# EAGLE design MotorControl (EAGLE 5.03)
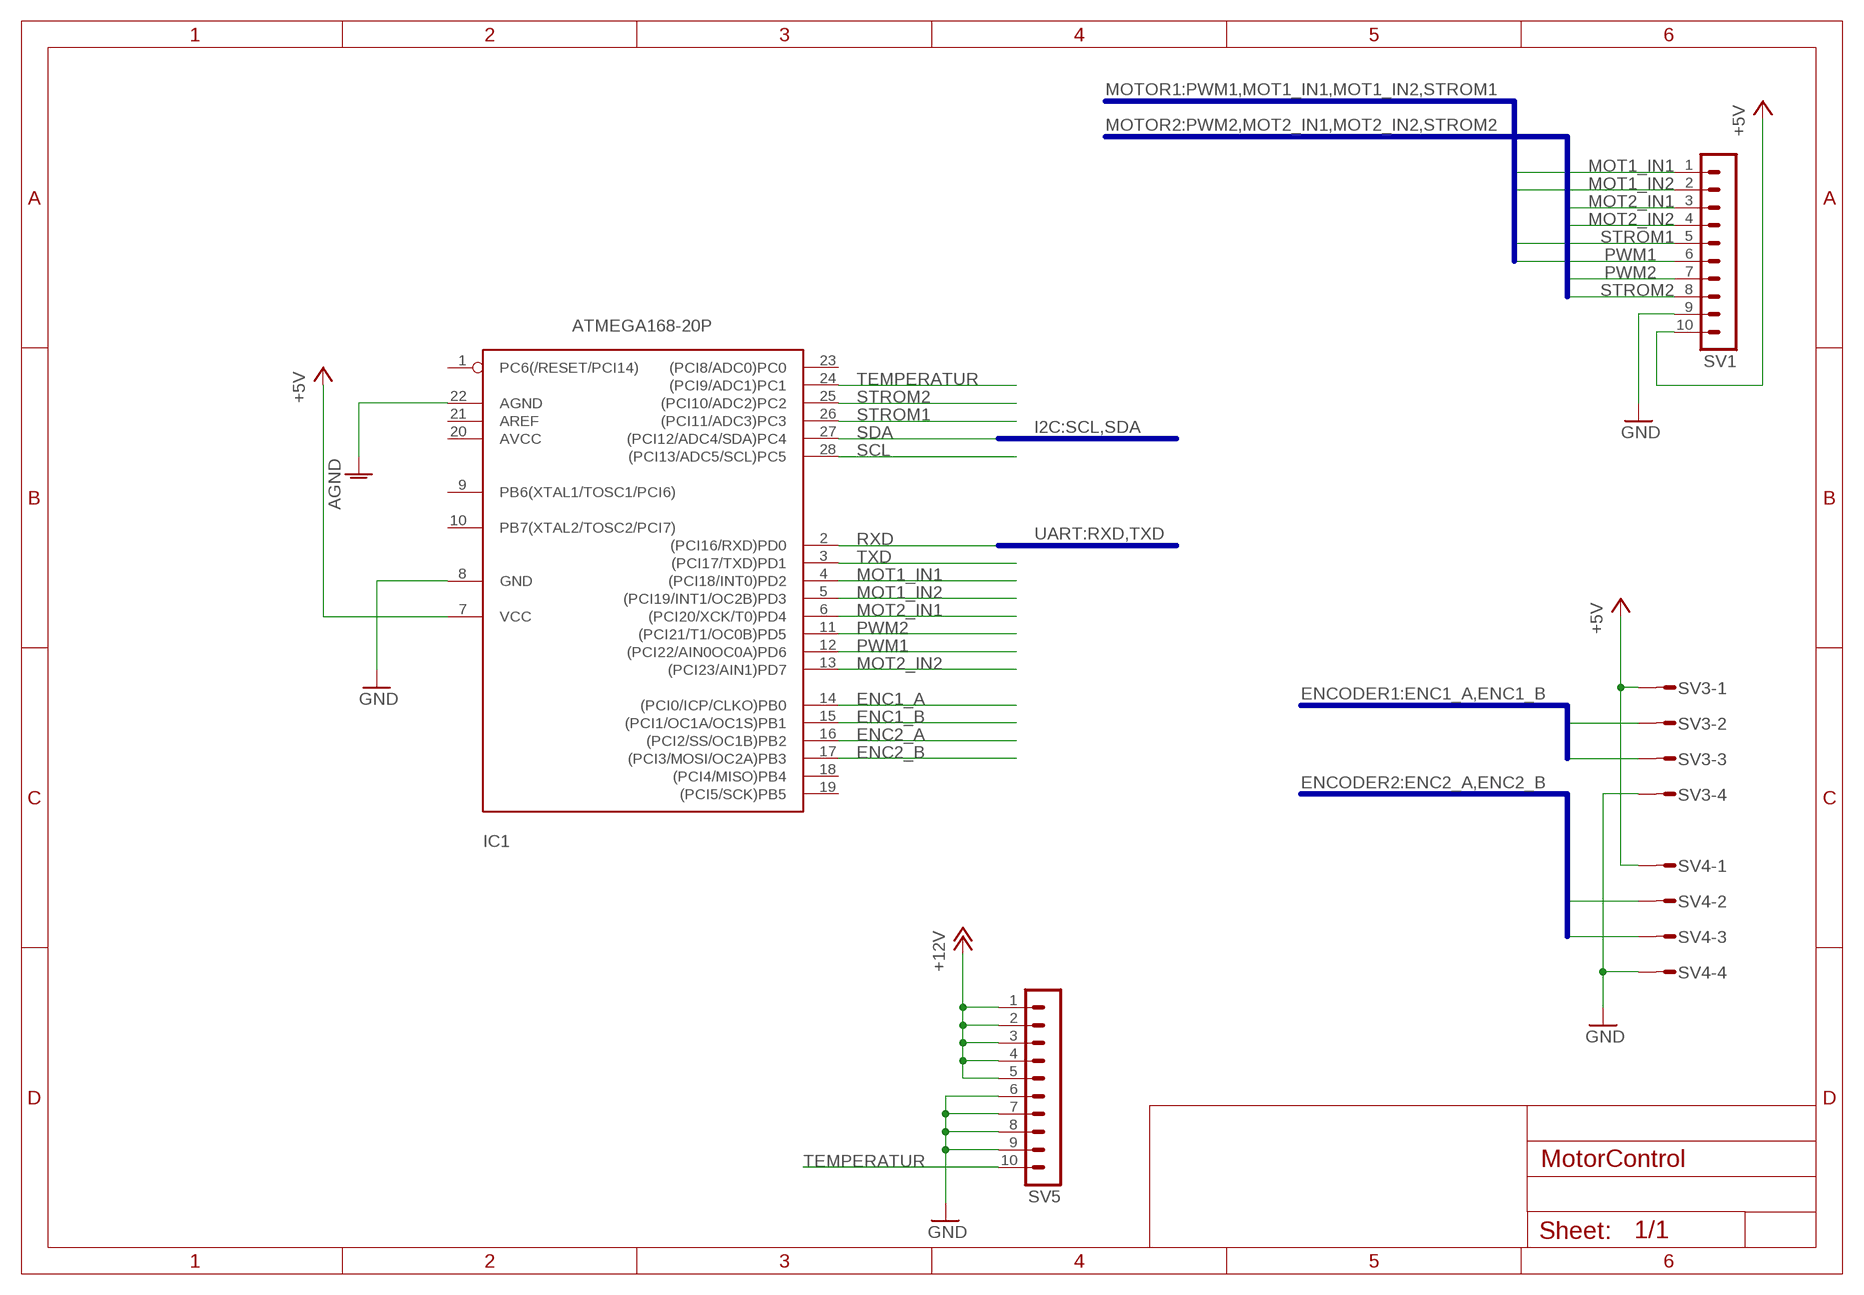
[diagram p0: schematic, sheet 1]

## Parts
IC1  ATMEGA168-20P  [DIL28-3]
SV1  MA10-1  [MA10-1]
SV3  S05P  [S05P]
SV4  S05P  [S05P]
SV5  MA10-1  [MA10-1]

## Nets
+5V: IC1.7(VCC) SV1.10 SV3.1 SV4.1
+12V: SV5.1 SV5.2 SV5.3 SV5.4 SV5.5
AGND: IC1.22(AGND)
ENC1_A: IC1.14((PCI0/ICP/CLKO)PB0) SV3.3
ENC1_B: IC1.15((PCI1/OC1A/OC1S)PB1) SV3.2
ENC2_A: IC1.16((PCI2/SS/OC1B)PB2) SV4.3
ENC2_B: IC1.17((PCI3/MOSI/OC2A)PB3) SV4.2
GND: IC1.8(GND) SV1.9 SV3.4 SV4.4 SV5.6 SV5.7 SV5.8 SV5.9
MOT1_IN1: IC1.4((PCI18/INT0)PD2) SV1.1
MOT1_IN2: IC1.5((PCI19/INT1/OC2B)PD3) SV1.2
MOT2_IN1: IC1.6((PCI20/XCK/T0)PD4) SV1.3
MOT2_IN2: IC1.13((PCI23/AIN1)PD7) SV1.4
PWM1: IC1.12((PCI22/AIN0OC0A)PD6) SV1.6
PWM2: IC1.11((PCI21/T1/OC0B)PD5) SV1.7
RXD: IC1.2((PCI16/RXD)PD0)
SCL: IC1.28((PCI13/ADC5/SCL)PC5)
SDA: IC1.27((PCI12/ADC4/SDA)PC4)
STROM1: IC1.26((PCI11/ADC3)PC3) SV1.5
STROM2: IC1.25((PCI10/ADC2)PC2) SV1.8
TEMPERATUR: IC1.24((PCI9/ADC1)PC1) SV5.10
TXD: IC1.3((PCI17/TXD)PD1)
Unconnected: IC1.1(PC6(/RESET/PCI14)) IC1.9(PB6(XTAL1/TOSC1/PCI6)) IC1.10(PB7(XTAL2/TOSC2/PCI7)) IC1.18((PCI4/MISO)PB4) IC1.19((PCI5/SCK)PB5) IC1.20(AVCC) IC1.21(AREF) IC1.23((PCI8/ADC0)PC0) SV3.5 SV4.5

## Buses
I2C:SCL,SDA
UART:RXD,TXD
MOTOR1:PWM1,MOT1_IN1,MOT1_IN2,STROM1
MOTOR2:PWM2,MOT2_IN1,MOT2_IN2,STROM2
ENCODER1:ENC1_A,ENC1_B
ENCODER2:ENC2_A,ENC2_B

## Library data of the parts
IC1 = avr:ATMEGA168*P: MICROCONTROLLER 16 kBytes FLASH 1 kBytes SRAM 512 Bytes EEPROM USART 8-channel 10 bit ADC
SV1 SV5 = con-lstb:MA10-1: PIN HEADER
SV3 SV4 = con-amp-mt:S05P: AMP MT CONNECTOR

## Board
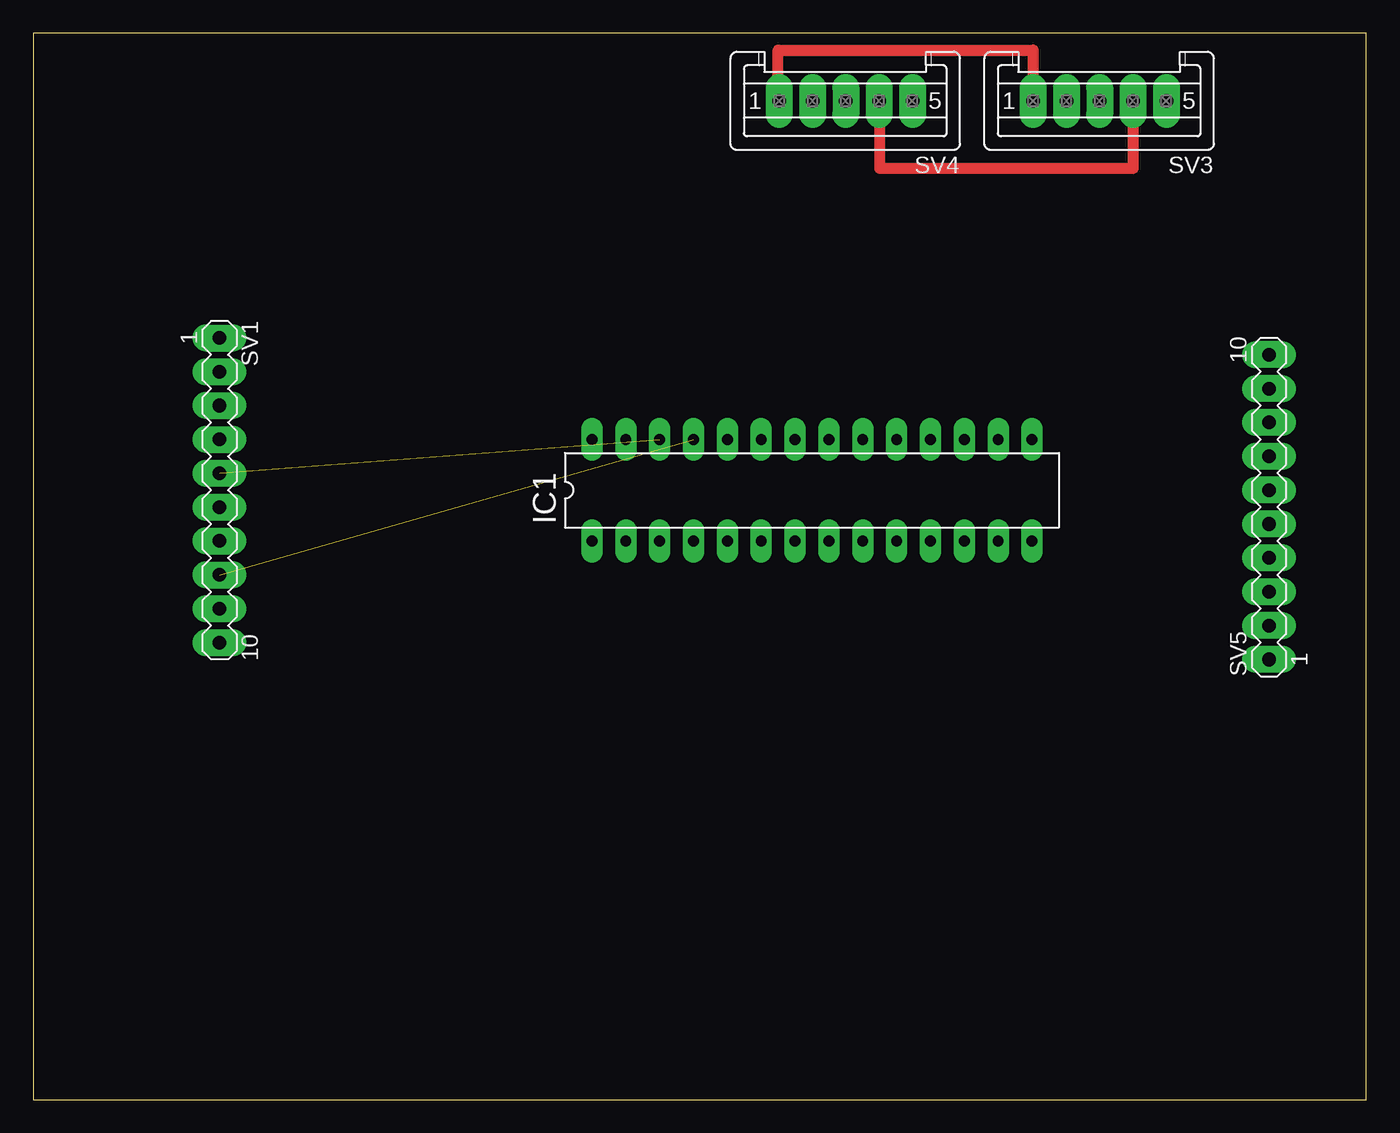
[diagram p1: board, top side]
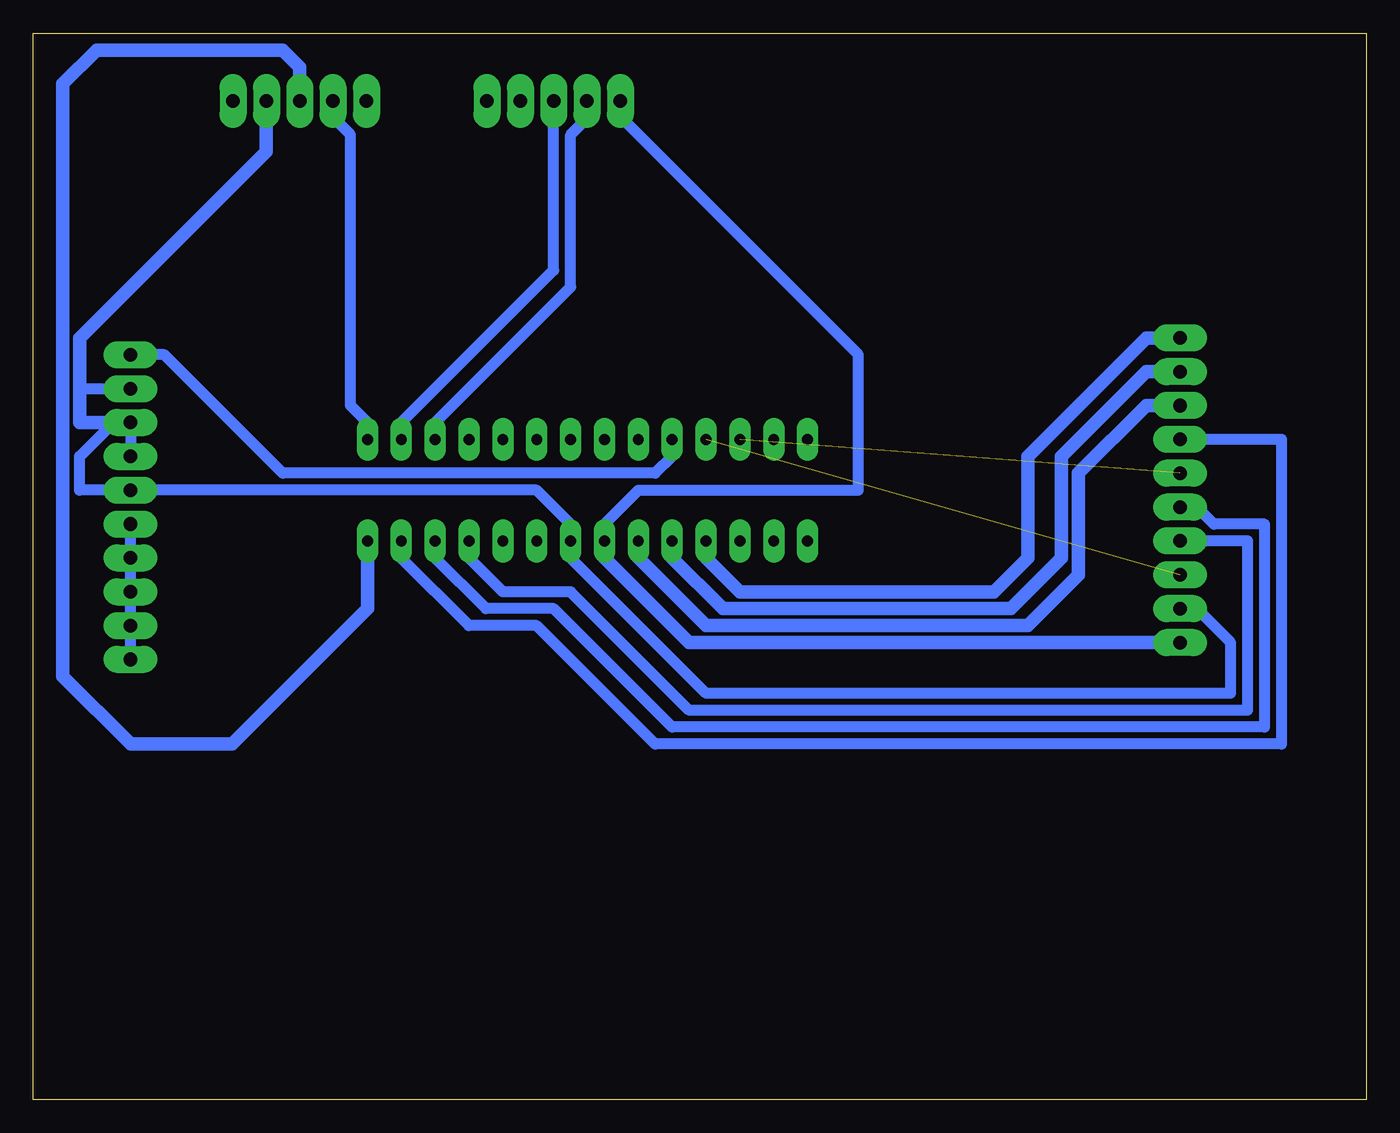
[diagram p2: board, bottom side, seen from below]

Size 100 x 80 mm. Coordinates in mm from the lower left corner, seen from the top.
Outline: 0,0 100,0 100,80 0,80 0,0
Copper layers (1*16): Top 0.035mm / dielectric 1.5mm / Bottom 0.035mm
Design rules "default *": minimum track width 32mil, minimum drill 31mil, track to track 12mil, track to pad 12mil, pad to pad 12mil, via to via 12mil, smd to smd 12mil, copper to edge 40mil, drill to drill 8mil, minimum pad ring 10mil, minimum via ring 8mil, stop-mask expansion 4mil, vias tented up to drill 0mil, thermal gap 10mil

### Footprints (pad centres in the part's own frame; a part is rotated, then mirrored left to right if it is on the bottom)
DIL28-3 = drill 0.813 long: 1 -16.51,-3.81; 2 -13.97,-3.81; 3 -11.43,-3.81; 4 -8.89,-3.81; 5 -6.35,-3.81; 6 -3.81,-3.81; 7 -1.27,-3.81; 8 1.27,-3.81; 9 3.81,-3.81; 10 6.35,-3.81; 11 8.89,-3.81; 12 11.43,-3.81; 13 13.97,-3.81; 14 16.51,-3.81; 15 16.51,3.81; 16 13.97,3.81; 17 11.43,3.81; 18 8.89,3.81; 19 6.35,3.81; 20 3.81,3.81; 21 1.27,3.81; 22 -1.27,3.81; 23 -3.81,3.81; 24 -6.35,3.81; 25 -8.89,3.81; 26 -11.43,3.81; 27 -13.97,3.81; 28 -16.51,3.81
MA10-1 = drill 1.016 long: 1 -11.43,0; 2 -8.89,0; 3 -6.35,0; 4 -3.81,0; 5 -1.27,0; 6 1.27,0; 7 3.81,0; 8 6.35,0; 9 8.89,0; 10 11.43,0
S05P = drill 1.016 long: 1 5,0; 2 2.5,0; 3 0,0; 4 -2.5,0; 5 -5,0

### Placement (x,y rotation side)
IC1  58.42,45.72 0 top
SV1  13.97,45.72 270 top
SV3  80.01,74.93 180 top
SV4  60.96,74.93 180 top
SV5  92.71,44.45 90 top

### Tracks (layer width: path | path; a pad name or v marks a point on that pad's centre or on a via)
+5V
  Top 0.813: SV4.1 55.88,74.93 55.88,78.74 75.01,78.74 SV3.1
  Bottom 0.813: SV4.1 55.88,73.66 38.1,55.88 38.1,45.72 54.61,45.72 57.15,43.18 IC1.7
  Bottom 1.016: SV1.10 50.8,34.29 57.15,40.64 IC1.7
+12V
  Bottom 0.813: SV5.1 SV5.2 SV5.3 SV5.4 SV5.5
ENC1_A
  Bottom 1.016: SV3.3 80.01,77.47 81.28,78.74 95.25,78.74 97.79,76.2 97.79,31.75 92.71,26.67 85.09,26.67 74.93,36.83 IC1.14
ENC1_B
  Bottom 0.813: IC1.15 74.93,50.8 76.2,52.07 76.2,72.39 77.47,73.66 SV3.2
ENC2_A
  Bottom 0.813: IC1.16 72.39,50.8 60.96,62.23 SV4.3
ENC2_B
  Bottom 0.813: IC1.17 69.85,50.8 59.69,60.96 59.69,72.39 58.42,73.66 SV4.2
GND
  Top 0.813: SV4.4 63.5,74.93 63.5,69.85 82.51,69.85 SV3.4
  Bottom 0.813: SV5.8 SV5.7 | 96.52,53.34 SV5.9 | SV1.9 12.7,36.83 10.16,34.29 10.16,30.48 49.53,30.48 59.69,40.64 IC1.8 59.69,43.18 62.23,45.72 SV5.6 96.52,45.72 96.52,48.26 93.98,50.8
  Bottom 1.016: SV5.8 93.98,50.8 96.52,50.8 96.52,53.34 96.52,57.15 82.55,71.12 82.55,74.89 SV3.4
MOT1_IN1
  Bottom 1.016: SV1.1 16.51,57.15 25.4,48.26 25.4,40.64 27.94,38.1 46.99,38.1 49.53,40.64 IC1.4
MOT1_IN2
  Bottom 1.016: IC1.5 52.07,40.64 48.26,36.83 26.67,36.83 22.86,40.64 22.86,48.26 16.51,54.61 SV1.2
MOT2_IN1
  Bottom 1.016: IC1.6 54.61,40.64 49.53,35.56 25.4,35.56 21.59,39.37 21.59,46.99 16.51,52.07 SV1.3
MOT2_IN2
  Bottom 0.813: IC1.13 72.39,40.64 67.31,35.56 62.23,35.56 53.34,26.67 6.35,26.67 6.35,49.53 SV1.4
PWM1
  Bottom 0.813: IC1.12 69.85,40.64 66.04,36.83 60.96,36.83 52.07,27.94 7.62,27.94 7.62,43.18 11.43,43.18 12.7,44.45 SV1.6
PWM2
  Bottom 0.813: IC1.11 67.31,40.64 64.77,38.1 59.69,38.1 50.8,29.21 8.89,29.21 8.89,41.91 SV1.7
STROM1  (1 unrouted)
STROM2  (1 unrouted)
TEMPERATUR
  Bottom 0.813: IC1.24 52.07,48.26 53.34,46.99 81.28,46.99 90.17,55.88 SV5.10